# Altium schematic sheet Register Connector.SchDoc
size B; Author: E. Sims; Organization: Let's Build Rockets Inc.; SheetNumber: 6; SheetTotal: 6
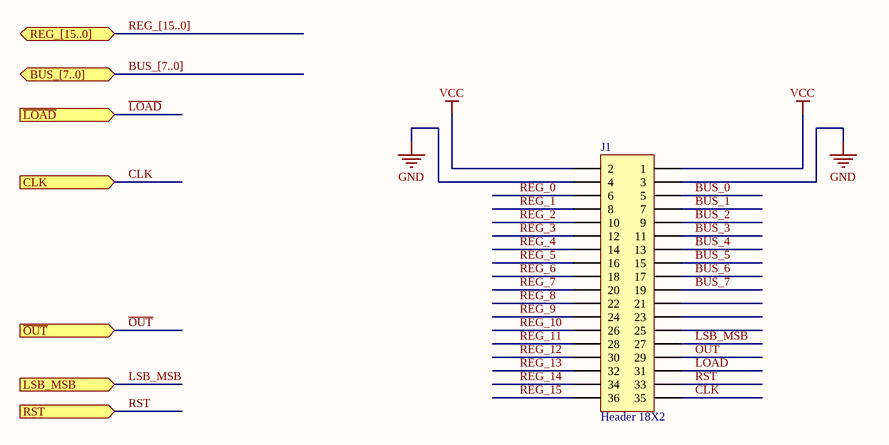
[diagram p0: Register Connector.SchDoc]

## Parts
J1  Header 18X2  [HDR2X18]

## Ports
BUS_[7..0] (bidir), CLK (in), LSB_MSB (in), REG_[15..0] (bidir), RST (in), ~{LOAD} (in), ~{OUT} (in)

## Nets
GND: J1.3 J1.4
VCC: J1.1 J1.2
BUS_0: J1.5
BUS_1: J1.7
BUS_2: J1.9
BUS_3: J1.11
BUS_4: J1.13
BUS_5: J1.15
BUS_6: J1.17
BUS_7: J1.19
CLK: J1.35 ; port CLK
~{LOAD}: J1.31 ; port ~{LOAD}
LSB_MSB: J1.27 ; port LSB_MSB
~{OUT}: J1.29 ; port ~{OUT}
REG_0: J1.6
REG_1: J1.8
REG_2: J1.10
REG_3: J1.12
REG_4: J1.14
REG_5: J1.16
REG_6: J1.18
REG_7: J1.20
REG_8: J1.22
REG_9: J1.24
REG_10: J1.26
REG_11: J1.28
REG_12: J1.30
REG_13: J1.32
REG_14: J1.34
REG_15: J1.36
RST: J1.33 ; port RST

Not connected (* = marked no-connect by the designer): J1 21 23 25

## Buses and harness runs
bus BUS_[7..0] = port BUS_[7..0]
bus REG_[15..0] = port REG_[15..0]

## Notes on the sheet
- Let's Build Rocket's Inc. Modular Paylaod System Based on TMP-010 Rev
  For more information visit https://github.com/LetsBuildRockets/Modular-Payload-System
  This work is licensed under CC BY-NC 4.0. To view a copy of this license, visit https://creativecommons.org/licenses/by-nc/4.0
- Title
- Size:
- Date:
- Assembly Variant:
- B
- Number:
- Time:
- Revision:
- Sheet
- of
- Author:
- File:

## Library data of the parts
J1 = Header 18X2: Header, 18-Pin, Dual row; LatestRevisionDate: 17-Jul-2002; LatestRevisionNote: Re-released for DXP Platform.; Publisher: Altium Limited